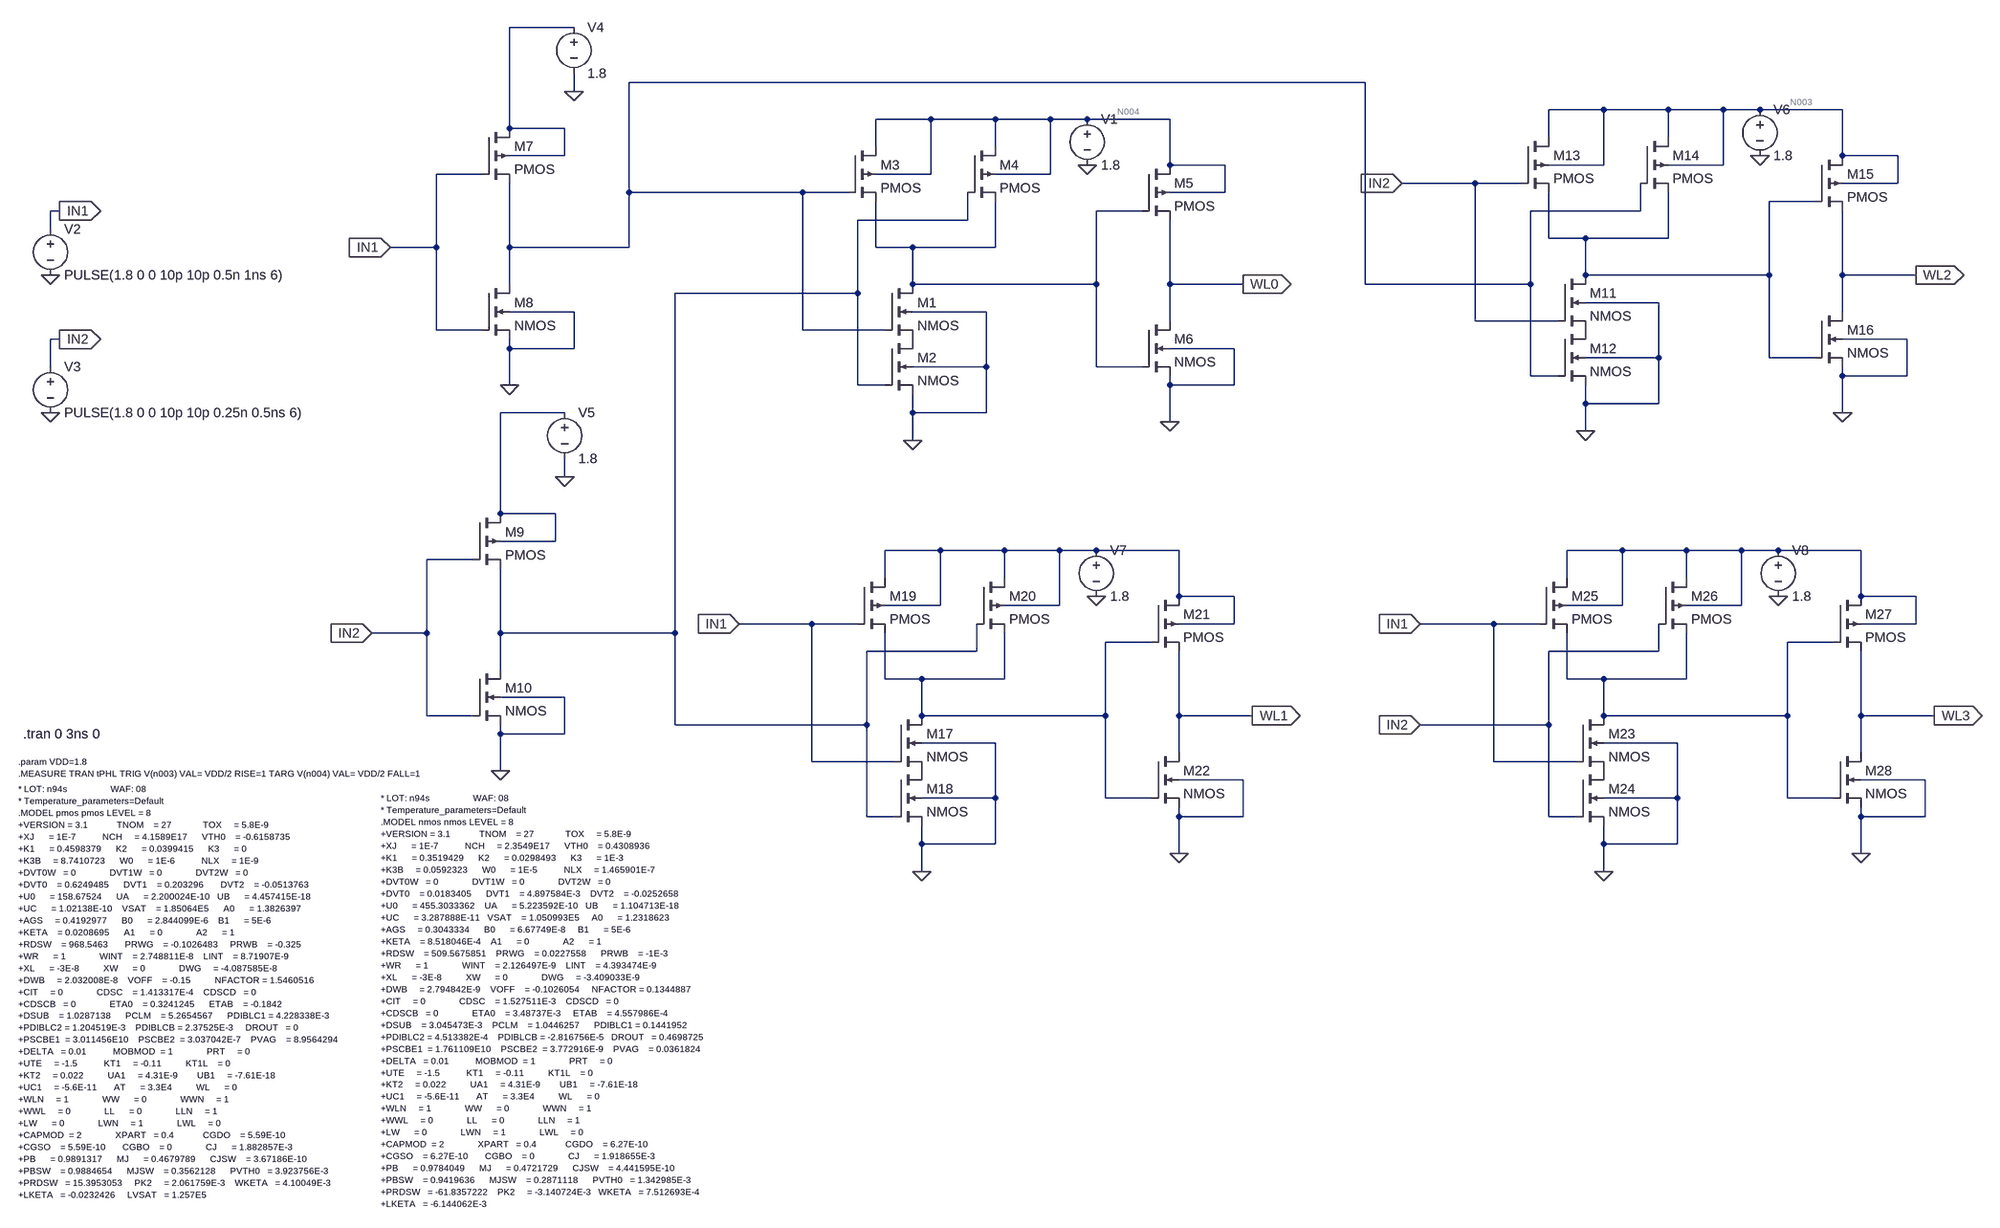
[diagram p0: schematic 2x4_DECODER.asc]
2x4_DECODER.asc, the LTspice schematic file:
Version 4
SHEET 1 2304 1752
WIRE -176 -112 -288 -112
WIRE 1216 -16 -80 -16
WIRE -176 0 -176 -32
WIRE 1632 32 1536 32
WIRE 1744 32 1632 32
WIRE 1840 32 1744 32
WIRE 1904 32 1840 32
WIRE 2048 32 1904 32
WIRE 448 48 352 48
WIRE 560 48 448 48
WIRE 656 48 560 48
WIRE 720 48 656 48
WIRE 864 48 720 48
WIRE -288 64 -288 -112
WIRE -192 64 -288 64
WIRE 1536 80 1536 32
WIRE 1744 80 1744 32
WIRE 352 96 352 48
WIRE 560 96 560 48
WIRE -192 112 -192 64
WIRE -192 112 -288 112
WIRE 2048 112 2048 32
WIRE 2144 112 2048 112
WIRE 864 128 864 48
WIRE 960 128 864 128
WIRE 1632 128 1632 32
WIRE 1632 128 1536 128
WIRE 1840 128 1840 32
WIRE 1840 128 1744 128
WIRE -336 144 -416 144
WIRE 448 144 448 48
WIRE 448 144 352 144
WIRE 656 144 656 48
WIRE 656 144 560 144
WIRE 1408 160 1280 160
WIRE 1488 160 1408 160
WIRE 2144 160 2144 112
WIRE 2144 160 2048 160
WIRE -80 176 -80 -16
WIRE 224 176 -80 176
WIRE 304 176 224 176
WIRE 960 176 960 128
WIRE 960 176 864 176
WIRE 2000 192 1920 192
WIRE -1072 208 -1088 208
WIRE 816 208 736 208
WIRE 1696 208 1696 160
WIRE 1696 208 1504 208
WIRE 512 224 512 176
WIRE 512 224 320 224
WIRE -1088 240 -1088 208
WIRE 1536 256 1536 176
WIRE 1600 256 1536 256
WIRE 1744 256 1744 176
WIRE 1744 256 1600 256
WIRE -416 272 -416 144
WIRE -416 272 -496 272
WIRE -288 272 -288 160
WIRE -80 272 -80 176
WIRE -80 272 -288 272
WIRE 352 272 352 192
WIRE 416 272 352 272
WIRE 560 272 560 192
WIRE 560 272 416 272
WIRE 1600 320 1600 256
WIRE 1920 320 1920 192
WIRE 1920 320 1600 320
WIRE 2048 320 2048 208
WIRE 2176 320 2048 320
WIRE -288 336 -288 272
WIRE 416 336 416 272
WIRE 736 336 736 208
WIRE 736 336 416 336
WIRE 864 336 864 224
WIRE 992 336 864 336
WIRE 1216 336 1216 -16
WIRE 1504 336 1504 208
WIRE 1504 336 1216 336
WIRE 320 352 320 224
WIRE 320 352 0 352
WIRE 1728 368 1600 368
WIRE -176 384 -288 384
WIRE 544 384 416 384
WIRE 2048 384 2048 320
WIRE 864 400 864 336
WIRE 1408 400 1408 160
WIRE 1552 400 1408 400
WIRE -416 416 -416 272
WIRE -336 416 -416 416
WIRE 224 416 224 176
WIRE 368 416 224 416
WIRE -1072 432 -1088 432
WIRE 2160 432 2048 432
WIRE -288 448 -288 432
WIRE -176 448 -176 384
WIRE -176 448 -288 448
WIRE 976 448 864 448
WIRE 1728 464 1728 368
WIRE 1728 464 1600 464
WIRE 1920 464 1920 320
WIRE 2000 464 1920 464
WIRE -1088 480 -1088 432
WIRE 544 480 544 384
WIRE 544 480 416 480
WIRE 736 480 736 336
WIRE 816 480 736 480
WIRE 1504 496 1504 336
WIRE 1552 496 1504 496
WIRE 2048 496 2048 480
WIRE 2160 496 2160 432
WIRE 2160 496 2048 496
WIRE -288 512 -288 448
WIRE 320 512 320 352
WIRE 368 512 320 512
WIRE 864 512 864 496
WIRE 976 512 976 448
WIRE 976 512 864 512
WIRE 1600 544 1600 512
WIRE 1728 544 1728 464
WIRE 1728 544 1600 544
WIRE -192 560 -304 560
WIRE 416 560 416 528
WIRE 544 560 544 480
WIRE 544 560 416 560
WIRE 2048 560 2048 496
WIRE 864 576 864 512
WIRE 1600 592 1600 544
WIRE 416 608 416 560
WIRE -192 672 -192 640
WIRE -304 736 -304 560
WIRE -208 736 -304 736
WIRE -208 784 -208 736
WIRE -208 784 -304 784
WIRE 464 800 368 800
WIRE 576 800 464 800
WIRE 672 800 576 800
WIRE 736 800 672 800
WIRE 880 800 736 800
WIRE 1664 800 1568 800
WIRE 1776 800 1664 800
WIRE 1872 800 1776 800
WIRE 1936 800 1872 800
WIRE 2080 800 1936 800
WIRE -352 816 -432 816
WIRE 368 848 368 800
WIRE 576 848 576 800
WIRE 1568 848 1568 800
WIRE 1776 848 1776 800
WIRE 880 880 880 800
WIRE 976 880 880 880
WIRE 2080 880 2080 800
WIRE 2176 880 2080 880
WIRE 464 896 464 800
WIRE 464 896 368 896
WIRE 672 896 672 800
WIRE 672 896 576 896
WIRE 1664 896 1664 800
WIRE 1664 896 1568 896
WIRE 1872 896 1872 800
WIRE 1872 896 1776 896
WIRE 240 928 112 928
WIRE 320 928 240 928
WIRE 976 928 976 880
WIRE 976 928 880 928
WIRE 1440 928 1312 928
WIRE 1520 928 1440 928
WIRE 2176 928 2176 880
WIRE 2176 928 2080 928
WIRE -432 944 -432 816
WIRE -432 944 -528 944
WIRE -304 944 -304 832
WIRE 0 944 0 352
WIRE 0 944 -304 944
WIRE 832 960 752 960
WIRE 2032 960 1952 960
WIRE 528 976 528 928
WIRE 528 976 336 976
WIRE 1728 976 1728 928
WIRE 1728 976 1536 976
WIRE -304 1008 -304 944
WIRE 368 1024 368 944
WIRE 432 1024 368 1024
WIRE 576 1024 576 944
WIRE 576 1024 432 1024
WIRE 1568 1024 1568 944
WIRE 1632 1024 1568 1024
WIRE 1776 1024 1776 944
WIRE 1776 1024 1632 1024
WIRE -192 1056 -304 1056
WIRE -432 1088 -432 944
WIRE -352 1088 -432 1088
WIRE 432 1088 432 1024
WIRE 752 1088 752 960
WIRE 752 1088 432 1088
WIRE 880 1088 880 976
WIRE 1008 1088 880 1088
WIRE 1632 1088 1632 1024
WIRE 1952 1088 1952 960
WIRE 1952 1088 1632 1088
WIRE 2080 1088 2080 976
WIRE 2208 1088 2080 1088
WIRE 0 1104 0 944
WIRE 336 1104 336 976
WIRE 336 1104 0 1104
WIRE 1536 1104 1536 976
WIRE 1536 1104 1312 1104
WIRE -304 1120 -304 1104
WIRE -192 1120 -192 1056
WIRE -192 1120 -304 1120
WIRE 560 1136 432 1136
WIRE 1760 1136 1632 1136
WIRE 880 1152 880 1088
WIRE 2080 1152 2080 1088
WIRE 240 1168 240 928
WIRE 384 1168 240 1168
WIRE 1440 1168 1440 928
WIRE 1584 1168 1440 1168
WIRE -304 1184 -304 1120
WIRE 992 1200 880 1200
WIRE 2192 1200 2080 1200
WIRE 560 1232 560 1136
WIRE 560 1232 432 1232
WIRE 752 1232 752 1088
WIRE 832 1232 752 1232
WIRE 1760 1232 1760 1136
WIRE 1760 1232 1632 1232
WIRE 1952 1232 1952 1088
WIRE 2032 1232 1952 1232
WIRE 336 1264 336 1104
WIRE 384 1264 336 1264
WIRE 880 1264 880 1248
WIRE 992 1264 992 1200
WIRE 992 1264 880 1264
WIRE 1536 1264 1536 1104
WIRE 1584 1264 1536 1264
WIRE 2080 1264 2080 1248
WIRE 2192 1264 2192 1200
WIRE 2192 1264 2080 1264
WIRE 432 1312 432 1280
WIRE 560 1312 560 1232
WIRE 560 1312 432 1312
WIRE 1632 1312 1632 1280
WIRE 1760 1312 1760 1232
WIRE 1760 1312 1632 1312
WIRE 880 1328 880 1264
WIRE 2080 1328 2080 1264
WIRE 432 1360 432 1312
WIRE 1632 1360 1632 1312
FLAG 720 128 0
FLAG 416 608 0
FLAG -1088 320 0
FLAG -1088 560 0
FLAG 864 576 0
FLAG -288 512 0
FLAG -176 0 0
FLAG -304 1184 0
FLAG -192 672 0
FLAG -496 272 IN1
IOPIN -496 272 In
FLAG -528 944 IN2
IOPIN -528 944 In
FLAG -1072 208 IN1
IOPIN -1072 208 Out
FLAG -1072 432 IN2
IOPIN -1072 432 Out
FLAG 1904 112 0
FLAG 1600 592 0
FLAG 2048 560 0
FLAG 736 880 0
FLAG 432 1360 0
FLAG 880 1328 0
FLAG 1936 880 0
FLAG 1632 1360 0
FLAG 2080 1328 0
FLAG 112 928 IN1
IOPIN 112 928 In
FLAG 1280 160 IN2
IOPIN 1280 160 In
FLAG 1312 928 IN1
IOPIN 1312 928 In
FLAG 1312 1104 IN2
IOPIN 1312 1104 In
FLAG 992 336 WL0
IOPIN 992 336 Out
FLAG 1008 1088 WL1
IOPIN 1008 1088 Out
FLAG 2176 320 WL2
IOPIN 2176 320 Out
FLAG 2208 1088 WL3
IOPIN 2208 1088 Out
SYMBOL nmos4 368 336 R0
SYMATTR InstName M1
SYMATTR Value2 l=180n w=880n
SYMBOL nmos4 368 432 R0
SYMATTR InstName M2
SYMATTR Value2 l=180n w=880n
SYMBOL pmos4 304 96 R0
SYMATTR InstName M3
SYMATTR Value2 l=180n w=880n
SYMBOL pmos4 512 96 R0
SYMATTR InstName M4
SYMATTR Value2 l=180n w=880n
SYMBOL Voltage 720 32 R0
SYMATTR InstName V1
SYMATTR Value 1.8
SYMBOL Voltage -1088 224 R0
SYMATTR InstName V2
SYMATTR Value PULSE(1.8 0 0 10p 10p 0.5n 1ns 6)
SYMBOL Voltage -1088 464 R0
SYMATTR InstName V3
SYMATTR Value PULSE(1.8 0 0 10p 10p 0.25n 0.5ns 6)
SYMBOL pmos4 816 128 R0
SYMATTR InstName M5
SYMATTR Value2 l=180n w=880n
SYMBOL nmos4 816 400 R0
SYMATTR InstName M6
SYMATTR Value2 l=180n w=440n
SYMBOL pmos4 -336 64 R0
SYMATTR InstName M7
SYMATTR Value2 l=180n w=880n
SYMBOL nmos4 -336 336 R0
SYMATTR InstName M8
SYMATTR Value2 l=180n w=440n
SYMBOL voltage -176 -128 R0
SYMATTR InstName V4
SYMATTR Value 1.8
SYMBOL pmos4 -352 736 R0
SYMATTR InstName M9
SYMATTR Value2 l=180n w=880n
SYMBOL nmos4 -352 1008 R0
SYMATTR InstName M10
SYMATTR Value2 l=180n w=440n
SYMBOL voltage -192 544 R0
SYMATTR InstName V5
SYMATTR Value 1.8
SYMBOL nmos4 1552 320 R0
SYMATTR InstName M11
SYMATTR Value2 l=180n w=880n
SYMBOL nmos4 1552 416 R0
SYMATTR InstName M12
SYMATTR Value2 l=180n w=880n
SYMBOL pmos4 1488 80 R0
SYMATTR InstName M13
SYMATTR Value2 l=180n w=880n
SYMBOL pmos4 1696 80 R0
SYMATTR InstName M14
SYMATTR Value2 l=180n w=880n
SYMBOL Voltage 1904 16 R0
SYMATTR InstName V6
SYMATTR Value 1.8
SYMBOL pmos4 2000 112 R0
SYMATTR InstName M15
SYMATTR Value2 l=180n w=880n
SYMBOL nmos4 2000 384 R0
SYMATTR InstName M16
SYMATTR Value2 l=180n w=440n
SYMBOL nmos4 384 1088 R0
SYMATTR InstName M17
SYMATTR Value2 l=180n w=880n
SYMBOL nmos4 384 1184 R0
SYMATTR InstName M18
SYMATTR Value2 l=180n w=880n
SYMBOL pmos4 320 848 R0
SYMATTR InstName M19
SYMATTR Value2 l=180n w=880n
SYMBOL pmos4 528 848 R0
SYMATTR InstName M20
SYMATTR Value2 l=180n w=880n
SYMBOL Voltage 736 784 R0
SYMATTR InstName V7
SYMATTR Value 1.8
SYMBOL pmos4 832 880 R0
SYMATTR InstName M21
SYMATTR Value2 l=180n w=880n
SYMBOL nmos4 832 1152 R0
SYMATTR InstName M22
SYMATTR Value2 l=180n w=440n
SYMBOL nmos4 1584 1088 R0
SYMATTR InstName M23
SYMATTR Value2 l=180n w=880n
SYMBOL nmos4 1584 1184 R0
SYMATTR InstName M24
SYMATTR Value2 l=180n w=880n
SYMBOL pmos4 1520 848 R0
SYMATTR InstName M25
SYMATTR Value2 l=180n w=880n
SYMBOL pmos4 1728 848 R0
SYMATTR InstName M26
SYMATTR Value2 l=180n w=880n
SYMBOL Voltage 1936 784 R0
SYMATTR InstName V8
SYMATTR Value 1.8
SYMBOL pmos4 2032 880 R0
SYMATTR InstName M27
SYMATTR Value2 l=180n w=880n
SYMBOL nmos4 2032 1152 R0
SYMATTR InstName M28
SYMATTR Value2 l=180n w=440n
TEXT -1144 1216 Left 1 !* LOT: n94s                  WAF: 08\n* Temperature_parameters=Default\n.MODEL pmos pmos LEVEL = 8\n+VERSION = 3.1            TNOM    = 27             TOX     = 5.8E-9\n+XJ      = 1E-7           NCH     = 4.1589E17      VTH0    = -0.6158735\n+K1      = 0.4598379      K2      = 0.0399415      K3      = 0\n+K3B     = 8.7410723      W0      = 1E-6           NLX     = 1E-9\n+DVT0W   = 0              DVT1W   = 0              DVT2W   = 0\n+DVT0    = 0.6249485      DVT1    = 0.203296       DVT2    = -0.0513763\n+U0      = 158.67524      UA      = 2.200024E-10   UB      = 4.457415E-18\n+UC      = 1.02138E-10    VSAT    = 1.85064E5      A0      = 1.3826397\n+AGS     = 0.4192977      B0      = 2.844099E-6    B1      = 5E-6\n+KETA    = 0.0208695      A1      = 0              A2      = 1\n+RDSW    = 968.5463       PRWG    = -0.1026483     PRWB    = -0.325\n+WR      = 1              WINT    = 2.748811E-8    LINT    = 8.71907E-9\n+XL      = -3E-8          XW      = 0              DWG     = -4.087585E-8\n+DWB     = 2.032008E-8    VOFF    = -0.15          NFACTOR = 1.5460516\n+CIT     = 0              CDSC    = 1.413317E-4    CDSCD   = 0\n+CDSCB   = 0              ETA0    = 0.3241245      ETAB    = -0.1842\n+DSUB    = 1.0287138      PCLM    = 5.2654567      PDIBLC1 = 4.228338E-3\n+PDIBLC2 = 1.204519E-3    PDIBLCB = 2.37525E-3     DROUT   = 0\n+PSCBE1  = 3.011456E10    PSCBE2  = 3.037042E-7    PVAG    = 8.9564294\n+DELTA   = 0.01           MOBMOD  = 1              PRT     = 0\n+UTE     = -1.5           KT1     = -0.11          KT1L    = 0\n+KT2     = 0.022          UA1     = 4.31E-9        UB1     = -7.61E-18\n+UC1     = -5.6E-11       AT      = 3.3E4          WL      = 0\n+WLN     = 1              WW      = 0              WWN     = 1\n+WWL     = 0              LL      = 0              LLN     = 1\n+LW      = 0              LWN     = 1              LWL     = 0\n+CAPMOD  = 2              XPART   = 0.4            CGDO    = 5.59E-10\n+CGSO    = 5.59E-10       CGBO    = 0              CJ      = 1.882857E-3\n+PB      = 0.9891317      MJ      = 0.4679789      CJSW    = 3.67186E-10\n+PBSW    = 0.9884654      MJSW    = 0.3562128      PVTH0   = 3.923756E-3\n+PRDSW   = 15.3953053     PK2     = 2.061759E-3    WKETA   = 4.10049E-3\n+LKETA   = -0.0232426     LVSAT   = 1.257E5
TEXT -512 1232 Left 1 !* LOT: n94s                  WAF: 08\n* Temperature_parameters=Default\n.MODEL nmos nmos LEVEL = 8\n+VERSION = 3.1            TNOM    = 27             TOX     = 5.8E-9\n+XJ      = 1E-7           NCH     = 2.3549E17      VTH0    = 0.4308936\n+K1      = 0.3519429      K2      = 0.0298493      K3      = 1E-3\n+K3B     = 0.0592323      W0      = 1E-5           NLX     = 1.465901E-7\n+DVT0W   = 0              DVT1W   = 0              DVT2W   = 0\n+DVT0    = 0.0183405      DVT1    = 4.897584E-3    DVT2    = -0.0252658\n+U0      = 455.3033362    UA      = 5.223592E-10   UB      = 1.104713E-18\n+UC      = 3.287888E-11   VSAT    = 1.050993E5     A0      = 1.2318623\n+AGS     = 0.3043334      B0      = 6.67749E-8     B1      = 5E-6\n+KETA    = 8.518046E-4    A1      = 0              A2      = 1\n+RDSW    = 509.5675851    PRWG    = 0.0227558      PRWB    = -1E-3\n+WR      = 1              WINT    = 2.126497E-9    LINT    = 4.393474E-9\n+XL      = -3E-8          XW      = 0              DWG     = -3.409033E-9\n+DWB     = 2.794842E-9    VOFF    = -0.1026054     NFACTOR = 0.1344887\n+CIT     = 0              CDSC    = 1.527511E-3    CDSCD   = 0\n+CDSCB   = 0              ETA0    = 3.48737E-3     ETAB    = 4.557986E-4\n+DSUB    = 3.045473E-3    PCLM    = 1.0446257      PDIBLC1 = 0.1441952\n+PDIBLC2 = 4.513382E-4    PDIBLCB = -2.816756E-5   DROUT   = 0.4698725\n+PSCBE1  = 1.761109E10    PSCBE2  = 3.772916E-9    PVAG    = 0.0361824\n+DELTA   = 0.01           MOBMOD  = 1              PRT     = 0\n+UTE     = -1.5           KT1     = -0.11          KT1L    = 0\n+KT2     = 0.022          UA1     = 4.31E-9        UB1     = -7.61E-18\n+UC1     = -5.6E-11       AT      = 3.3E4          WL      = 0\n+WLN     = 1              WW      = 0              WWN     = 1\n+WWL     = 0              LL      = 0              LLN     = 1\n+LW      = 0              LWN     = 1              LWL     = 0\n+CAPMOD  = 2              XPART   = 0.4            CGDO    = 6.27E-10\n+CGSO    = 6.27E-10       CGBO    = 0              CJ      = 1.918655E-3\n+PB      = 0.9784049      MJ      = 0.4721729      CJSW    = 4.441595E-10\n+PBSW    = 0.9419636      MJSW    = 0.2871118      PVTH0   = 1.342985E-3\n+PRDSW   = -61.8357222    PK2     = -3.140724E-3   WKETA   = 7.512693E-4\n+LKETA   = -6.144062E-3
TEXT -1136 1120 Left 2 !.tran 0 3ns 0
TEXT -1144 1168 Left 1 !.param VDD=1.8\n.MEASURE TRAN tPHL TRIG V(n003) VAL= VDD/2 RISE=1 TARG V(n004) VAL= VDD/2 FALL=1

The netlist it stands for:
* 2x4_DECODER.asc
M1 N006 N002 P001 0 NMOS l=180n w=880n
M2 P001 N007 0 0 NMOS l=180n w=880n
M3 N004 N002 N006 N004 PMOS l=180n w=880n
M4 N004 N007 N006 N004 PMOS l=180n w=880n
V1 N004 0 1.8
V2 IN1 0 PULSE(1.8 0 0 10p 10p 0.5n 1ns 6)
V3 IN2 0 PULSE(1.8 0 0 10p 10p 0.25n 0.5ns 6)
M5 N004 N006 WL0 N004 PMOS l=180n w=880n
M6 WL0 N006 0 0 NMOS l=180n w=440n
M7 N001 IN1 N002 N001 PMOS l=180n w=880n
M8 N002 IN1 0 0 NMOS l=180n w=440n
V4 N001 0 1.8
M9 N008 IN2 N007 N008 PMOS l=180n w=880n
M10 N007 IN2 0 0 NMOS l=180n w=440n
V5 N008 0 1.8
M11 N005 IN2 P002 0 NMOS l=180n w=880n
M12 P002 N002 0 0 NMOS l=180n w=880n
M13 N003 IN2 N005 N003 PMOS l=180n w=880n
M14 N003 N002 N005 N003 PMOS l=180n w=880n
V6 N003 0 1.8
M15 N003 N005 WL2 N003 PMOS l=180n w=880n
M16 WL2 N005 0 0 NMOS l=180n w=440n
M17 N011 IN1 P003 0 NMOS l=180n w=880n
M18 P003 N007 0 0 NMOS l=180n w=880n
M19 N009 IN1 N011 N009 PMOS l=180n w=880n
M20 N009 N007 N011 N009 PMOS l=180n w=880n
V7 N009 0 1.8
M21 N009 N011 WL1 N009 PMOS l=180n w=880n
M22 WL1 N011 0 0 NMOS l=180n w=440n
M23 N012 IN1 P004 0 NMOS l=180n w=880n
M24 P004 IN2 0 0 NMOS l=180n w=880n
M25 N010 IN1 N012 N010 PMOS l=180n w=880n
M26 N010 IN2 N012 N010 PMOS l=180n w=880n
V8 N010 0 1.8
M27 N010 N012 WL3 N010 PMOS l=180n w=880n
M28 WL3 N012 0 0 NMOS l=180n w=440n
.model NMOS NMOS
.model PMOS PMOS
.lib standard.mos
* LOT: n94s                  WAF: 08
* Temperature_parameters=Default
.MODEL pmos pmos LEVEL = 8
+VERSION = 3.1            TNOM    = 27             TOX     = 5.8E-9
+XJ      = 1E-7           NCH     = 4.1589E17      VTH0    = -0.6158735
+K1      = 0.4598379      K2      = 0.0399415      K3      = 0
+K3B     = 8.7410723      W0      = 1E-6           NLX     = 1E-9
+DVT0W   = 0              DVT1W   = 0              DVT2W   = 0
+DVT0    = 0.6249485      DVT1    = 0.203296       DVT2    = -0.0513763
+U0      = 158.67524      UA      = 2.200024E-10   UB      = 4.457415E-18
+UC      = 1.02138E-10    VSAT    = 1.85064E5      A0      = 1.3826397
+AGS     = 0.4192977      B0      = 2.844099E-6    B1      = 5E-6
+KETA    = 0.0208695      A1      = 0              A2      = 1
+RDSW    = 968.5463       PRWG    = -0.1026483     PRWB    = -0.325
+WR      = 1              WINT    = 2.748811E-8    LINT    = 8.71907E-9
+XL      = -3E-8          XW      = 0              DWG     = -4.087585E-8
+DWB     = 2.032008E-8    VOFF    = -0.15          NFACTOR = 1.5460516
+CIT     = 0              CDSC    = 1.413317E-4    CDSCD   = 0
+CDSCB   = 0              ETA0    = 0.3241245      ETAB    = -0.1842
+DSUB    = 1.0287138      PCLM    = 5.2654567      PDIBLC1 = 4.228338E-3
+PDIBLC2 = 1.204519E-3    PDIBLCB = 2.37525E-3     DROUT   = 0
+PSCBE1  = 3.011456E10    PSCBE2  = 3.037042E-7    PVAG    = 8.9564294
+DELTA   = 0.01           MOBMOD  = 1              PRT     = 0
+UTE     = -1.5           KT1     = -0.11          KT1L    = 0
+KT2     = 0.022          UA1     = 4.31E-9        UB1     = -7.61E-18
+UC1     = -5.6E-11       AT      = 3.3E4          WL      = 0
+WLN     = 1              WW      = 0              WWN     = 1
+WWL     = 0              LL      = 0              LLN     = 1
+LW      = 0              LWN     = 1              LWL     = 0
+CAPMOD  = 2              XPART   = 0.4            CGDO    = 5.59E-10
+CGSO    = 5.59E-10       CGBO    = 0              CJ      = 1.882857E-3
+PB      = 0.9891317      MJ      = 0.4679789      CJSW    = 3.67186E-10
+PBSW    = 0.9884654      MJSW    = 0.3562128      PVTH0   = 3.923756E-3
+PRDSW   = 15.3953053     PK2     = 2.061759E-3    WKETA   = 4.10049E-3
+LKETA   = -0.0232426     LVSAT   = 1.257E5
* LOT: n94s                  WAF: 08
* Temperature_parameters=Default
.MODEL nmos nmos LEVEL = 8
+VERSION = 3.1            TNOM    = 27             TOX     = 5.8E-9
+XJ      = 1E-7           NCH     = 2.3549E17      VTH0    = 0.4308936
+K1      = 0.3519429      K2      = 0.0298493      K3      = 1E-3
+K3B     = 0.0592323      W0      = 1E-5           NLX     = 1.465901E-7
+DVT0W   = 0              DVT1W   = 0              DVT2W   = 0
+DVT0    = 0.0183405      DVT1    = 4.897584E-3    DVT2    = -0.0252658
+U0      = 455.3033362    UA      = 5.223592E-10   UB      = 1.104713E-18
+UC      = 3.287888E-11   VSAT    = 1.050993E5     A0      = 1.2318623
+AGS     = 0.3043334      B0      = 6.67749E-8     B1      = 5E-6
+KETA    = 8.518046E-4    A1      = 0              A2      = 1
+RDSW    = 509.5675851    PRWG    = 0.0227558      PRWB    = -1E-3
+WR      = 1              WINT    = 2.126497E-9    LINT    = 4.393474E-9
+XL      = -3E-8          XW      = 0              DWG     = -3.409033E-9
+DWB     = 2.794842E-9    VOFF    = -0.1026054     NFACTOR = 0.1344887
+CIT     = 0              CDSC    = 1.527511E-3    CDSCD   = 0
+CDSCB   = 0              ETA0    = 3.48737E-3     ETAB    = 4.557986E-4
+DSUB    = 3.045473E-3    PCLM    = 1.0446257      PDIBLC1 = 0.1441952
+PDIBLC2 = 4.513382E-4    PDIBLCB = -2.816756E-5   DROUT   = 0.4698725
+PSCBE1  = 1.761109E10    PSCBE2  = 3.772916E-9    PVAG    = 0.0361824
+DELTA   = 0.01           MOBMOD  = 1              PRT     = 0
+UTE     = -1.5           KT1     = -0.11          KT1L    = 0
+KT2     = 0.022          UA1     = 4.31E-9        UB1     = -7.61E-18
+UC1     = -5.6E-11       AT      = 3.3E4          WL      = 0
+WLN     = 1              WW      = 0              WWN     = 1
+WWL     = 0              LL      = 0              LLN     = 1
+LW      = 0              LWN     = 1              LWL     = 0
+CAPMOD  = 2              XPART   = 0.4            CGDO    = 6.27E-10
+CGSO    = 6.27E-10       CGBO    = 0              CJ      = 1.918655E-3
+PB      = 0.9784049      MJ      = 0.4721729      CJSW    = 4.441595E-10
+PBSW    = 0.9419636      MJSW    = 0.2871118      PVTH0   = 1.342985E-3
+PRDSW   = -61.8357222    PK2     = -3.140724E-3   WKETA   = 7.512693E-4
+LKETA   = -6.144062E-3
.tran 0 3ns 0
.param VDD=1.8
.MEASURE TRAN tPHL TRIG V(n003) VAL= VDD/2 RISE=1 TARG V(n004) VAL= VDD/2 FALL=1
.backanno
.end